# EAGLE design squid version 14 (EAGLE 6.4)
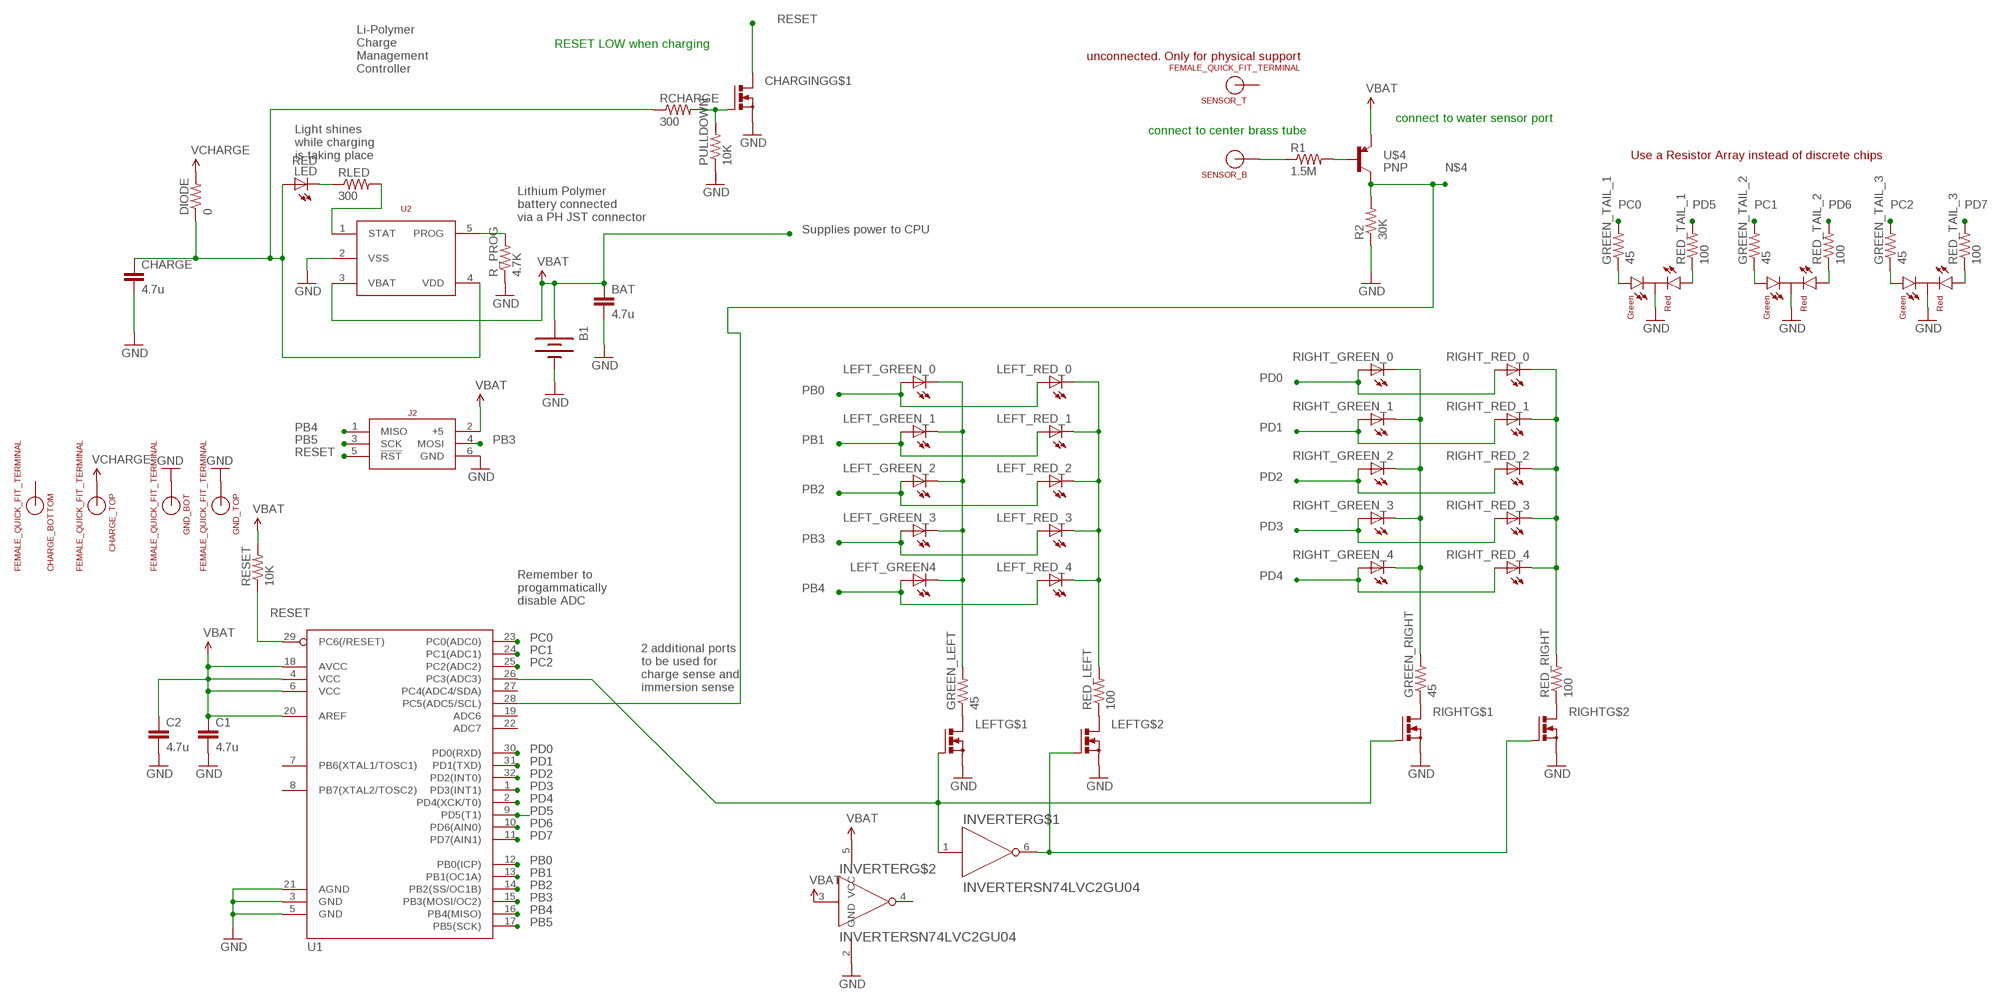
[diagram p0: schematic, sheet 1]

## Parts
B1  COIN_CELL_BATTERYJST  [JST_SM]
BAT  4.7u  CAP1206  [1206]
C1  4.7u  CAP1206  [1206]
C2  4.7u  CAP1206  [1206]
CENTER  LED_RED_GREEN_CC  [LED_KINGBRIGHT_BICOLOR_INDICATOR_LAMP]
CHARGE  4.7u  CAP1206  [1206]
CHARGE_BOTTOM  FEMALE_QUICK_FIT_TERMINAL  [HORIZONTAL_QUICK_CONNECT_3547]
CHARGE_TOP  FEMALE_QUICK_FIT_TERMINAL  [HORIZONTAL_QUICK_CONNECT_3547]
CHARGING  MOSFET_N_DUAL  [SOT-23-6]
DIODE  0  RESISTOR0805-RES  [0805]
GND_BOT  FEMALE_QUICK_FIT_TERMINAL  [HORIZONTAL_QUICK_CONNECT_3547]
GND_TOP  FEMALE_QUICK_FIT_TERMINAL  [HORIZONTAL_QUICK_CONNECT_3547]
GREEN_LEFT  45  RESISTOR0805-RES  [0805]
GREEN_RIGHT  45  RESISTOR0805-RES  [0805]
GREEN_TAIL_1  45  RESISTOR0805-RES  [0805]
GREEN_TAIL_2  45  RESISTOR0805-RES  [0805]
GREEN_TAIL_3  45  RESISTOR0805-RES  [0805]
INVERTER  INVERTERSN74LVC2GU04  [SOT-23-6]
J2  ATMEL_PROGRAMMER_HEADERNL  [TC2030-INC-NL]
LED  RED  LEDCHIP-LED0805  [CHIP-LED0805]
LEFT  MOSFET_N_DUAL  [SOT-23-6]
LEFT_GREEN4  LEDPLCC2  [BIVAR_2-PLCC]
LEFT_GREEN_0  LEDPLCC2  [BIVAR_2-PLCC]
LEFT_GREEN_1  LEDPLCC2  [BIVAR_2-PLCC]
LEFT_GREEN_2  LEDPLCC2  [BIVAR_2-PLCC]
LEFT_GREEN_3  LEDPLCC2  [BIVAR_2-PLCC]
LEFT_RED_0  LEDPLCC2  [BIVAR_2-PLCC]
LEFT_RED_1  LEDPLCC2  [BIVAR_2-PLCC]
LEFT_RED_2  LEDPLCC2  [BIVAR_2-PLCC]
LEFT_RED_3  LEDPLCC2  [BIVAR_2-PLCC]
LEFT_RED_4  LEDPLCC2  [BIVAR_2-PLCC]
PULLDOWN  10K  RESISTOR0805-RES  [0805]
R1  1.5M  RESISTOR0805-RES  [0805]
R2  30K  RESISTOR0805-RES  [0805]
R_PROG  4.7K  RESISTOR0805-RES  [0805]
RCHARGE  300  RESISTOR0805-RES  [0805]
RED_LEFT  100  RESISTOR0805-RES  [0805]
RED_RIGHT  100  RESISTOR0805-RES  [0805]
RED_TAIL_1  100  RESISTOR0805-RES  [0805]
RED_TAIL_2  100  RESISTOR0805-RES  [0805]
RED_TAIL_3  100  RESISTOR0805-RES  [0805]
RESET  10K  RESISTOR0805-RES  [0805]
RIGHT  MOSFET_N_DUAL  [SOT-23-6]
RIGHT_GREEN_0  LEDPLCC2  [BIVAR_2-PLCC]
RIGHT_GREEN_1  LEDPLCC2  [BIVAR_2-PLCC]
RIGHT_GREEN_2  LEDPLCC2  [BIVAR_2-PLCC]
RIGHT_GREEN_3  LEDPLCC2  [BIVAR_2-PLCC]
RIGHT_GREEN_4  LEDPLCC2  [BIVAR_2-PLCC]
RIGHT_RED_0  LEDPLCC2  [BIVAR_2-PLCC]
RIGHT_RED_1  LEDPLCC2  [BIVAR_2-PLCC]
RIGHT_RED_2  LEDPLCC2  [BIVAR_2-PLCC]
RIGHT_RED_3  LEDPLCC2  [BIVAR_2-PLCC]
RIGHT_RED_4  LEDPLCC2  [BIVAR_2-PLCC]
RLED  300  RESISTOR0805-RES  [0805]
SENSOR_B  FEMALE_QUICK_FIT_TERMINAL  [HORIZONTAL_QUICK_CONNECT_3547]
SENSOR_T  FEMALE_QUICK_FIT_TERMINAL  [HORIZONTAL_QUICK_CONNECT_3547]
U1  ATMEGA328_SMT  [TQFP32-08]
U2  MCP73832  [SOT-23(OT)5_LEAD]
U$4  PNP  [SOT-23]
U$7  LED_RED_GREEN_CC  [LED_KINGBRIGHT_BICOLOR_INDICATOR_LAMP]
U$13  LED_RED_GREEN_CC  [LED_KINGBRIGHT_BICOLOR_INDICATOR_LAMP]

## Nets
GND: B1.GND(-) BAT.2 C1.2 C2.2 CENTER.2(C) CHARGE.2 CHARGING.4(S) GND_BOT.1 GND_TOP.1 INVERTER.2(GND) J2.6(GND) LEFT.1(S) LEFT.4(S) PULLDOWN.1 R2.1 R_PROG.1 RIGHT.1(S) RIGHT.4(S) U1.3(GND) U1.5(GND) U1.21(AGND) U2.2(VSS) U$7.2(C) U$13.2(C)
GREEN_LEFT_CATHODE: GREEN_LEFT.2 LEFT_GREEN4.C LEFT_GREEN_0.C LEFT_GREEN_1.C LEFT_GREEN_2.C LEFT_GREEN_3.C
N$1: R1.2 U$4.1(B)
N$2: INVERTER.6(Y) LEFT.2(G) RIGHT.2(G)
N$3: CHARGING.5(G) PULLDOWN.2 RCHARGE.2
N$4: R2.2 U1.28(PC5(ADC5/SCL)) U$4.3(C)
N$5: GREEN_LEFT.1 LEFT.3(D)
N$6: LEFT.6(D) RED_LEFT.1
N$7: INVERTER.1(A) LEFT.5(G) RIGHT.5(G) U1.26(PC3(ADC3))
N$8: GREEN_RIGHT.1 RIGHT.3(D)
N$9: R1.1 SENSOR_B.1
N$10: RED_RIGHT.1 RIGHT.6(D)
N$11: GREEN_RIGHT.2 RIGHT_GREEN_0.C RIGHT_GREEN_1.C RIGHT_GREEN_2.C RIGHT_GREEN_3.C RIGHT_GREEN_4.C
N$12: RED_RIGHT.2 RIGHT_RED_0.C RIGHT_RED_1.C RIGHT_RED_2.C RIGHT_RED_3.C RIGHT_RED_4.C
N$14: LED.C RLED.1
N$15: R_PROG.2 U2.5(PROG)
N$17: GREEN_TAIL_1.1 U$7.3(GREEN)
N$20: CENTER.3(GREEN) GREEN_TAIL_2.1
N$21: CHARGE.1 DIODE.1 LED.A RCHARGE.1 U2.4(VDD)
N$22: GREEN_TAIL_3.1 U$13.3(GREEN)
N$23: RED_TAIL_1.1 U$7.1(RED)
N$24: CENTER.1(RED) RED_TAIL_2.1
N$25: RED_TAIL_3.1 U$13.1(RED)
PB0: LEFT_GREEN_0.A LEFT_RED_0.A U1.12(PB0(ICP))
PB1: LEFT_GREEN_1.A LEFT_RED_1.A U1.13(PB1(OC1A))
PB2: LEFT_GREEN_2.A LEFT_RED_2.A U1.14(PB2(SS/OC1B))
PB3: J2.4(MOSI) LEFT_GREEN_3.A LEFT_RED_3.A U1.15(PB3(MOSI/OC2))
PB4: J2.1(MISO) LEFT_GREEN4.A LEFT_RED_4.A U1.16(PB4(MISO))
PB5: J2.3(SCK) U1.17(PB5(SCK))
PC0: GREEN_TAIL_1.2 U1.23(PC0(ADC0))
PC1: GREEN_TAIL_2.2 U1.24(PC1(ADC1))
PC2: GREEN_TAIL_3.2 U1.25(PC2(ADC2))
PD0: RIGHT_GREEN_0.A RIGHT_RED_0.A U1.30(PD0(RXD))
PD1: RIGHT_GREEN_1.A RIGHT_RED_1.A U1.31(PD1(TXD))
PD2: RIGHT_GREEN_2.A RIGHT_RED_2.A U1.32(PD2(INT0))
PD3: RIGHT_GREEN_3.A RIGHT_RED_3.A U1.1(PD3(INT1))
PD4: RIGHT_GREEN_4.A RIGHT_RED_4.A U1.2(PD4(XCK/T0))
PD5: RED_TAIL_1.2 U1.9(PD5(T1))
PD6: RED_TAIL_2.2 U1.10(PD6(AIN0))
PD7: RED_TAIL_3.2 U1.11(PD7(AIN1))
RED_LEFT_CATHODE: LEFT_RED_0.C LEFT_RED_1.C LEFT_RED_2.C LEFT_RED_3.C LEFT_RED_4.C RED_LEFT.2
RESET: CHARGING.3(D) J2.5(!RST!) RESET.1 U1.29(PC6(/RESET))
STAT: RLED.2 U2.1(STAT)
VBAT: B1.VCC(+) BAT.1 C1.1 C2.1 INVERTER.3(A) INVERTER.5(VCC) J2.2(+5) RESET.2 U1.4(VCC) U1.6(VCC) U1.18(AVCC) U1.20(AREF) U2.3(VBAT) U$4.2(E)
VCHARGE: CHARGE_TOP.1 DIODE.2
Unconnected: CHARGE_BOTTOM.1 CHARGING.1(S) CHARGING.2(G) CHARGING.6(D) INVERTER.4(Y) SENSOR_T.1 U1.7(PB6(XTAL1/TOSC1)) U1.8(PB7(XTAL2/TOSC2)) U1.19(ADC6) U1.22(ADC7) U1.27(PC4(ADC4/SDA))

## Notes on the sheet
- RESET LOW when charging
- unconnected. Only for physical support
- Li-Polymer
  Charge
  Management
  Controller
- connect to water sensor port
- connect to center brass tube
- Light shines
  while charging
  is taking place
- Use a Resistor Array instead of discrete chips
- Lithium Polymer
  battery connected
  via a PH JST connector
- Supplies power to CPU
- Remember to
  progammatically
  disable ADC
- 2 additional ports
  to be used for
  charge sense and
  immersion sense

## Library data of the parts
B1 = Keystone:COIN_CELL_BATTERY
BAT C1 C2 CHARGE = SparkFun:CAP: Capacitor Standard 0603 ceramic capacitor, and 0.1" leaded capacitor.
CENTER U$7 U$13 = ERIC:LED_RED_GREEN_CC
CHARGE_BOTTOM CHARGE_TOP GND_BOT GND_TOP SENSOR_B SENSOR_T = Keystone:FEMALE_QUICK_FIT_TERMINAL
CHARGING LEFT RIGHT = ERIC:MOSFET_N_DUAL
DIODE PULLDOWN R1 R2 R_PROG RCHARGE RESET RLED = SparkFun:RESISTOR: Resistor Basic schematic elements and footprints for 0603, 1206, and PTH resistors.
GREEN_LEFT GREEN_RIGHT GREEN_TAIL_1-GREEN_TAIL_3 RED_LEFT RED_RIGHT RED_TAIL_1-RED_TAIL_3 = SparkFun-Passives:RESISTOR: Resistor Basic schematic elements and footprints for 0603, 1206, and PTH resistors.
INVERTER = ERIC:INVERTER: Dual NOT gate
J2 = ERIC:ATMEL_PROGRAMMER_HEADER: Board connector for Atmel MkII ISP programmer
LED = led:LED: LED OSRAM: - CHIPLED LG R971, LG N971, LY N971, LG Q971, LY Q971, LO R971, LY R971 LH N974, LH R974 LS Q976, LO Q976, LY Q976 LO Q996 - Hyper CHIPLED LW Q18S LB Q993, LB Q99A, LB R99A - SideLED LS A670, LO A670, LY A670, LG A670, LP A670 LB A673, LV A673, LT A673, LW A673 LH A674 LY A675 LS A676, LA A676, LO A676, LY A676, LW A676 LS A679, LY A679, LG A679 - Hyper Micro SIDELED® LS Y876, LA Y876, LO Y876, LY Y876 LT Y87S - SmartLED LW L88C, LW L88S LB L89C, LB L89S, LG L890 LS L89K, LO L89K, LY L89K LS L896, LA L896, LO L896, LY L896 - TOPLED LS T670, LO T670, LY T670, LG T670, LP T670 LSG T670, LSP T670, LSY T670, LOP T670, LYG T670 LG T671, LOG T671, LSG T671 LB T673, LV T673, LT T673, LW T673 LH T674 LS T676, LA T676, LO T676, LY T676, LB T676, LH T676, LSB T676, LW T676 LB T67C, LV T67C, LT T67C, LS T67K, LO T67K, LY T67K, LW E67C LS E67B, LA E67B, LO E67B, LY E67B, LB E67C, LV E67C, LT E67C LW T67C LS T679, LY T679, LG T679 LS T770, LO T770, LY T770, LG T770, LP T770 LB T773, LV T773, LT T773, LW T773 LH T774 LS E675, LA E675, LY E675, LS T675 LS T776, LA T776, LO T776, LY T776, LB T776 LHGB T686 LT T68C, LB T68C - Hyper Mini TOPLED® LB M676 - Mini TOPLED Santana® LG M470 LS M47K, LO M47K, LY M47K Source: http://www.osram.convergy.de LUXEON: - LUMILED® LXK2-PW12-R00, LXK2-PW12-S00, LXK2-PW14-U00, LXK2-PW14-V00 LXK2-PM12-R00, LXK2-PM12-S00, LXK2-PM14-U00 LXK2-PE12-Q00, LXK2-PE12-R00, LXK2-PE12-S00, LXK2-PE14-T00, LXK2-PE14-U00 LXK2-PB12-K00, LXK2-PB12-L00, LXK2-PB12-M00, LXK2-PB14-N00, LXK2-PB14-P00, LXK2-PB14-Q00 LXK2-PR12-L00, LXK2-PR12-M00, LXK2-PR14-Q00, LXK2-PR14-R00 LXK2-PD12-Q00, LXK2-PD12-R00, LXK2-PD12-S00 LXK2-PH12-R00, LXK2-PH12-S00 LXK2-PL12-P00, LXK2-PL12-Q00, LXK2-PL12-R00 Source: www.luxeon.com KINGBRIGHT: KA-3528ASYC Source: www.kingbright.com
LEFT_GREEN4 LEFT_GREEN_0 LEFT_GREEN_1-LEFT_GREEN_3 LEFT_RED_0 LEFT_RED_1-LEFT_RED_4 RIGHT_GREEN_0 RIGHT_GREEN_1-RIGHT_GREEN_4 RIGHT_RED_0 RIGHT_RED_1-RIGHT_RED_4 = ERIC:LED: LED OSRAM: - CHIPLED LG R971, LG N971, LY N971, LG Q971, LY Q971, LO R971, LY R971 LH N974, LH R974 LS Q976, LO Q976, LY Q976 LO Q996 - Hyper CHIPLED LW Q18S LB Q993, LB Q99A, LB R99A - SideLED LS A670, LO A670, LY A670, LG A670, LP A670 LB A673, LV A673, LT A673, LW A673 LH A674 LY A675 LS A676, LA A676, LO A676, LY A676, LW A676 LS A679, LY A679, LG A679 - Hyper Micro SIDELED® LS Y876, LA Y876, LO Y876, LY Y876 LT Y87S - SmartLED LW L88C, LW L88S LB L89C, LB L89S, LG L890 LS L89K, LO L89K, LY L89K LS L896, LA L896, LO L896, LY L896 - TOPLED LS T670, LO T670, LY T670, LG T670, LP T670 LSG T670, LSP T670, LSY T670, LOP T670, LYG T670 LG T671, LOG T671, LSG T671 LB T673, LV T673, LT T673, LW T673 LH T674 LS T676, LA T676, LO T676, LY T676, LB T676, LH T676, LSB T676, LW T676 LB T67C, LV T67C, LT T67C, LS T67K, LO T67K, LY T67K, LW E67C LS E67B, LA E67B, LO E67B, LY E67B, LB E67C, LV E67C, LT E67C LW T67C LS T679, LY T679, LG T679 LS T770, LO T770, LY T770, LG T770, LP T770 LB T773, LV T773, LT T773, LW T773 LH T774 LS E675, LA E675, LY E675, LS T675 LS T776, LA T776, LO T776, LY T776, LB T776 LHGB T686 LT T68C, LB T68C - Hyper Mini TOPLED® LB M676 - Mini TOPLED Santana® LG M470 LS M47K, LO M47K, LY M47K Source: http://www.osram.convergy.de LUXEON: - LUMILED® LXK2-PW12-R00, LXK2-PW12-S00, LXK2-PW14-U00, LXK2-PW14-V00 LXK2-PM12-R00, LXK2-PM12-S00, LXK2-PM14-U00 LXK2-PE12-Q00, LXK2-PE12-R00, LXK2-PE12-S00, LXK2-PE14-T00, LXK2-PE14-U00 LXK2-PB12-K00, LXK2-PB12-L00, LXK2-PB12-M00, LXK2-PB14-N00, LXK2-PB14-P00, LXK2-PB14-Q00 LXK2-PR12-L00, LXK2-PR12-M00, LXK2-PR14-Q00, LXK2-PR14-R00 LXK2-PD12-Q00, LXK2-PD12-R00, LXK2-PD12-S00 LXK2-PH12-R00, LXK2-PH12-S00 LXK2-PL12-P00, LXK2-PL12-Q00, LXK2-PL12-R00 Source: www.luxeon.com KINGBRIGHT: KA-3528ASYC Source: www.kingbright.com
U1 = SparkFun-DigitalIC:ATMEGA328_SMT: 32-Pin Atmega328 part Commonly used on Arduino compatible boards Available in QFP and QFN packages TQFP is IC-09069 QFN is non-stock; PROD_ID: IC-09069; VALUE: ATMEGA328P
U2 = ERIC:MCP73832: Lithium Ion/Lithium Polymer Charge Management Controller
U$4 = ERIC:PNP

## Net classes
0 default: width 0.3 mm

## Board
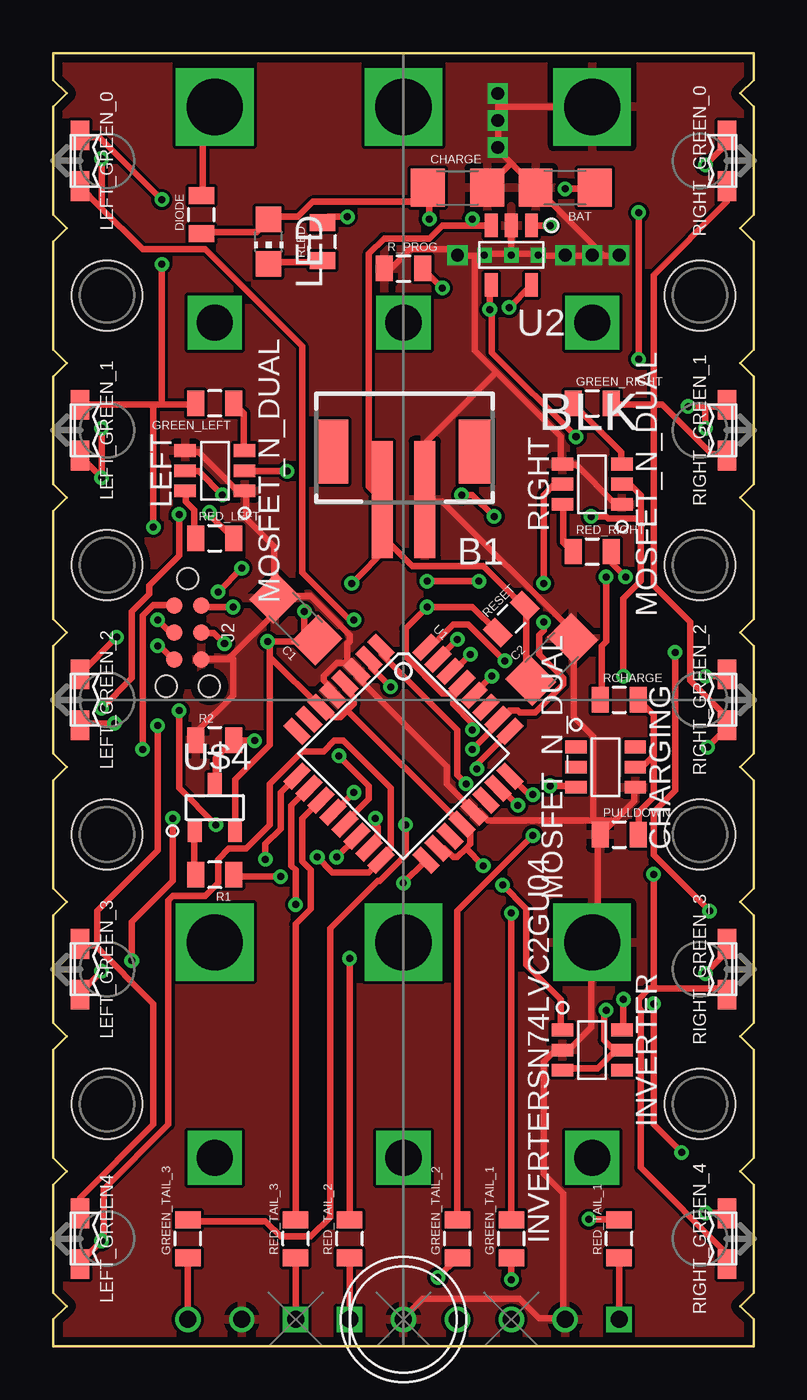
[diagram p1: board, top side]
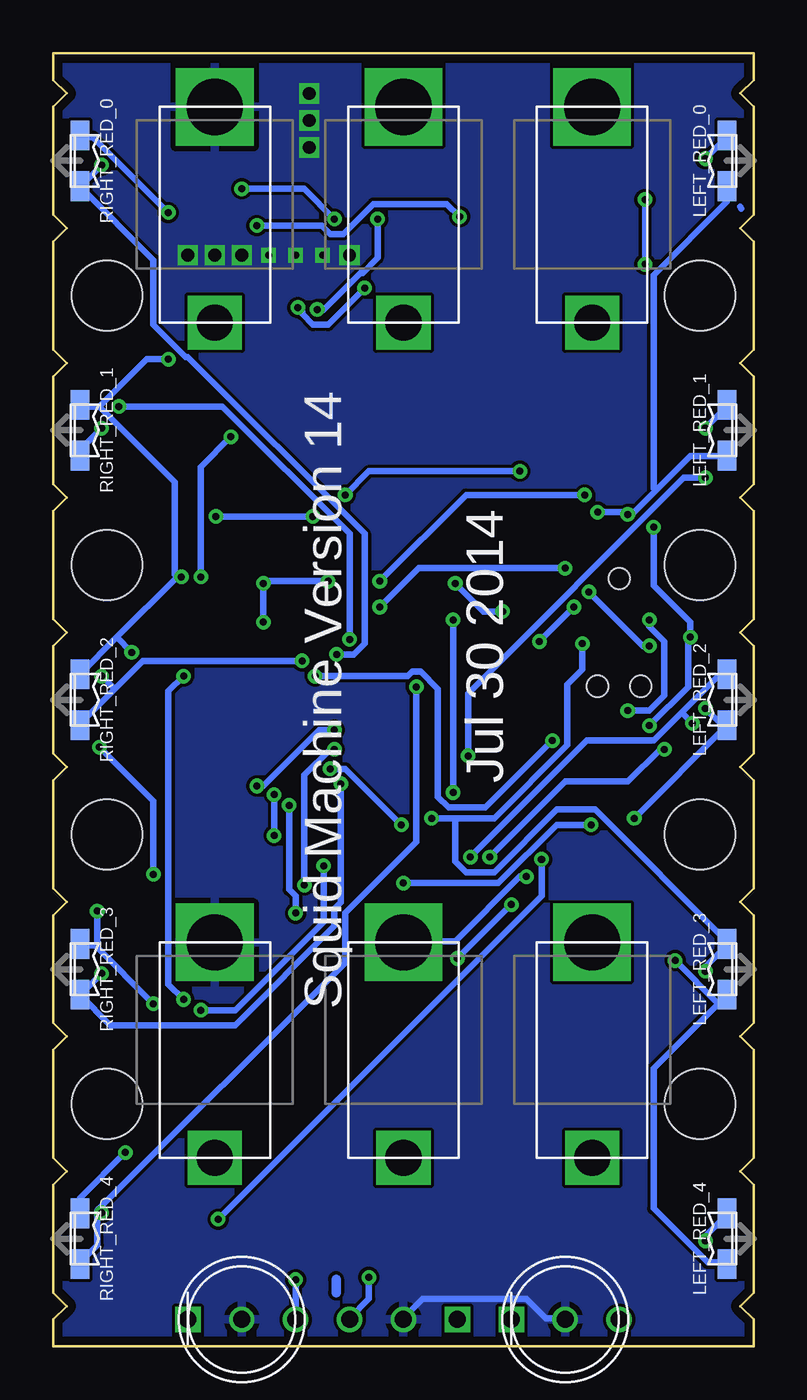
[diagram p2: board, bottom side, seen from below]

Size 33.02 x 60.96 mm. Coordinates in mm from the lower left corner, seen from the top.
Copper layers (1*16): Top 0.0356mm / dielectric 1.5011mm / Bottom 0.0356mm
Design rules "LaenPCBOrder *": minimum track width 6mil, minimum drill 13mil, track to track 6mil, track to pad 6mil, pad to pad 6mil, via to via 6mil, smd to smd 6mil, copper to edge 15mil, drill to drill 6mil, minimum pad ring 7mil, minimum via ring 7mil, stop-mask expansion 4mil, vias tented up to drill 0mil, thermal gap 10mil
Holes 3.3 mm at 2.54,11.43 30.48,11.43 2.54,49.53 30.48,49.53 2.54,36.83 2.54,24.13 30.48,24.13 30.48,36.83

### Footprints (pad centres in the part's own frame; a part is rotated, then mirrored left to right if it is on the bottom)
JST_SM = smd 1 x 5.5: GND 1,-2; VCC -1,-2 | smd 1.6 x 3: P$1 -3.4,0.27; P$2 3.4,0.27
1206 = smd 1.6 x 1.8: 1 -1.4,0; 2 1.4,0
LED_KINGBRIGHT_BICOLOR_INDICATOR_LAMP = drill 0.8 square: 1 0,2.54 | drill 0.8: 2 0,0; 3 0,-2.54
HORIZONTAL_QUICK_CONNECT_3547 = drill 2.642 square: 1 0,5.08 | drill 1.702 square: 2 0,-5.08
SOT-23-6 = smd 0.6 x 1: 1 -0.95,-1.4; 2 0,-1.4; 3 0.95,-1.4; 4 0.95,1.4; 5 0,1.4; 6 -0.95,1.4
0805 = smd 0.8 x 1.2: 1 -0.9,0; 2 0.9,0
TC2030-INC-NL = smd 0.787 x 0.787: 1 1.27,-0.635; 2 1.27,0.635; 3 2.54,-0.635; 4 2.54,0.635; 5 3.81,-0.635; 6 3.81,0.635 | hole 0.991: 0,0; 5.08,1.016; 5.08,-1.016
CHIP-LED0805 = smd 1.2 x 1.2: A 0,-1.05; C 0,1.05
BIVAR_2-PLCC = smd 1.397 x 0.889: A 1.194,0; C -1.194,0
TQFP32-08 = smd 1.27 x 0.559: 1 -4.293,2.8; 2 -4.293,2; 3 -4.293,1.2; 4 -4.293,0.4; 5 -4.293,-0.4; 6 -4.293,-1.2; 7 -4.293,-2; 8 -4.293,-2.8; 17 4.293,-2.8; 18 4.293,-2; 19 4.293,-1.2; 20 4.293,-0.4; 21 4.293,0.4; 22 4.293,1.2; 23 4.293,2; 24 4.293,2.8 | smd 0.559 x 1.27: 9 -2.8,-4.293; 10 -2,-4.293; 11 -1.2,-4.293; 12 -0.4,-4.293; 13 0.4,-4.293; 14 1.2,-4.293; 15 2,-4.293; 16 2.8,-4.293; 25 2.8,4.293; 26 2,4.293; 27 1.2,4.293; 28 0.4,4.293; 29 -0.4,4.293; 30 -1.2,4.293; 31 -2,4.293; 32 -2.8,4.293
SOT-23(OT)5_LEAD = smd 0.6 x 1.1: 1 -0.95,-1.4; 2 0,-1.4; 3 0.95,-1.4; 4 0.95,1.4; 5 -0.95,1.4
SOT-23 = smd 0.65 x 1.05: 1 -0.95,-1.1; 2 0.95,-1.1; 3 0,1.1

### Placement (x,y rotation side)
B1  16.51,41.91 0 top
BAT  24.13,54.61 180 top
C1  11.43,34.29 135 top
C2  23.5,32.38 45 top
CENTER  16.51,1.27 90 top
CHARGE  19.05,54.61 0 top
CHARGE_BOTTOM  7.62,13.97 0 bottom
CHARGE_TOP  7.62,53.34 0 bottom
CHARGING  26.04,27.3 270 top
DIODE  6.99,53.34 90 top
GND_BOT  25.4,53.34 0 bottom
GND_TOP  25.4,13.97 0 bottom
GREEN_LEFT  7.62,44.45 180 top
GREEN_RIGHT  25.4,44.45 0 top
GREEN_TAIL_1  21.59,5.08 90 top
GREEN_TAIL_2  19.05,5.08 90 top
GREEN_TAIL_3  6.35,5.08 90 top
INVERTER  25.4,13.97 270 top
J2  6.35,36.2 270 top
LED  10.16,52.07 180 top
LEFT  7.62,41.27 90 top
LEFT_GREEN4  1.27,5.08 270 top
LEFT_GREEN_0  1.27,55.88 270 top
LEFT_GREEN_1  1.27,43.18 270 top
LEFT_GREEN_2  1.27,30.48 270 top
LEFT_GREEN_3  1.27,17.78 270 top
LEFT_RED_0  1.27,55.88 90 bottom
LEFT_RED_1  1.27,43.18 90 bottom
LEFT_RED_2  1.27,30.48 90 bottom
LEFT_RED_3  1.27,17.78 90 bottom
LEFT_RED_4  1.27,5.08 90 bottom
PULLDOWN  26.67,24.13 0 top
R1  7.62,22.23 180 top
R2  7.62,28.57 0 top
R_PROG  16.51,50.8 0 top
RCHARGE  26.67,30.48 0 top
RED_LEFT  7.62,38.1 0 top
RED_RIGHT  25.4,37.47 0 top
RED_TAIL_1  26.67,5.08 90 top
RED_TAIL_2  13.97,5.08 90 top
RED_TAIL_3  11.43,5.08 90 top
RESET  21.59,34.29 45 top
RIGHT  25.4,40.64 90 top
RIGHT_GREEN_0  31.75,55.88 90 top
RIGHT_GREEN_1  31.75,43.18 90 top
RIGHT_GREEN_2  31.75,30.48 90 top
RIGHT_GREEN_3  31.75,17.78 90 top
RIGHT_GREEN_4  31.75,5.08 90 top
RIGHT_RED_0  31.75,55.88 270 bottom
RIGHT_RED_1  31.75,43.18 270 bottom
RIGHT_RED_2  31.75,30.48 270 bottom
RIGHT_RED_3  31.75,17.78 270 bottom
RIGHT_RED_4  31.75,5.08 270 bottom
RLED  12.7,52.07 90 top
SENSOR_B  16.51,13.97 0 bottom
SENSOR_T  16.51,53.34 0 bottom
U1  16.51,27.94 315 top
U2  21.59,51.44 180 top
U$4  7.62,25.4 0 top
U$7  24.13,1.27 90 bottom
U$12  [SQUID_14]  16.51,30.48 0 top
U$13  8.89,1.27 90 bottom

### Tracks (layer width: path | path; a pad name or v marks a point on that pad's centre or on a via)
GND  (via drill 0.33, 0.6)
  Top 0.3: 20.98,58.42 20.98,59.03 v20.96,59.05 | 20.98,58.42 20.98,57.91 v20.96,57.78 20.98,57.71 20.98,56.59 v20.96,56.52 20.98,56.39 21.59,55.78 | 21.59,55.78 22.71,54.66 BAT.2 22.81,54.56 25.86,51.51 v25.4,51.44 | 21.59,55.78 20.47,54.66 CHARGE.2 | GND_BOT.1 20.98,58.42 | RIGHT.1 26.77,39.73 26.47,39.73 24.64,41.55 24.03,41.55 RIGHT.4 23.93,41.66 23.93,42.88 20.88,45.92 | v21.59,51.44 21.59,51.51 20.37,51.51 v20.32,51.44 20.27,51.41 19.86,51.41 | v21.59,51.44 21.69,51.51 22.81,51.51 v22.86,51.44 22.91,51.41 24.13,51.41 v24.13,51.44 24.23,51.41 25.35,51.41 v25.4,51.44 | 19.86,51.41 19.05,51.41 v19.05,51.44 18.95,51.51 18.75,51.71 16.82,51.71 15.9,50.8 R_PROG.1 | v26.67,51.44 26.67,51.41 25.45,51.41 v25.4,51.44 | v21.59,51.44 U2.2 | 20.88,45.92 19.86,46.94 19.86,51.41 | 20.88,45.92 17.53,42.57 17.53,39.93 B1.GND 17.63,39.83 18.34,39.83 24.43,33.73 24.43,33.43 C2.2 24.54,33.33 24.54,29.67 25.45,28.75 25.45,24.79 | LEFT.4 6.25,42.16 6.86,42.16 8.69,40.34 8.99,40.34 LEFT.1 9.09,40.23 9.09,39.01 10.41,37.69 10.41,35.46 C1.2 | 13.87,32.21 13.97,32.21 14.28,31.9 U1.3 14.38,31.7 14.38,31.5 18.54,27.33 18.54,26.52 19.76,25.3 U1.21 19.86,25.09 20.17,25.09 20.47,24.79 25.45,24.79 | 13.87,32.21 13.36,32.21 12.75,31.6 12.75,31.39 13.16,30.99 13.16,30.79 U1.5 | 7.06,32.41 J2.6 7.16,32.41 8.28,32.41 8.38,32.51 | 8.38,32.51 10.41,34.54 10.41,35.26 C1.2 | R2.1 6.76,28.65 6.76,28.96 8.48,30.68 8.48,32.41 8.38,32.51 | 13.87,32.21 13.87,33.12 13.97,33.22 13.97,33.53 12.14,35.36 10.52,35.36 C1.2 | CENTER.2 16.51,1.32 17.42,2.23 22,2.23 22.91,1.32 24.13,1.32 U$7.2 24.03,1.42 24.03,7.21 23.11,8.13 23.11,13.41 23.62,13.92 23.93,13.92 INVERTER.2
  Top 0.3: 26.37,24.69 25.86,24.18 PULLDOWN.1 25.65,24.08 25.65,19.3 GND_TOP.1 25.35,19 25.35,15.04 24.43,14.12 24.13,14.12 INVERTER.2 | 26.37,24.69 27.38,25.7 27.38,26.31 CHARGING.4 | 25.45,24.79 26.26,24.79 26.37,24.69 | 24.03,14.02 INVERTER.2
  Bottom 0.3: U$13.2 8.89,1.32 9.8,1.32 10.72,2.23 15.6,2.23 16.51,1.32 CENTER.2
  pour Top: -7.62,68.58 40.64,68.58 40.64,-12.7 -7.62,-12.7
  pour Bottom: -5.08,73.66 38.1,73.66 38.1,-20.32 -5.08,-20.32
GND15
  Bottom 0.45: 19.68,3.17 19.68,2.54
GREEN_LEFT_CATHODE  (via drill 0.33)
  Top 0.3: LEFT_GREEN4.C 1.27,7.01 4.72,10.46 4.72,16.15 1.98,18.9 | 1.98,18.9 1.27,18.9 LEFT_GREEN_3.C | 4.72,44.4 1.27,44.4 LEFT_GREEN_1.C | 4.72,44.4 5.13,44.4 | 5.13,44.4 6.66,44.4 GREEN_LEFT.2 | v3,33.43 1.27,31.7 LEFT_GREEN_2.C | 4.72,44.4 v4.72,38.61 | v5.13,54.05 2.18,57 1.27,57 LEFT_GREEN_0.C | 5.13,44.4 v5.13,51 | v4.93,29.26 4.93,23.37 2.08,20.52 2.08,19 1.98,18.9
  Bottom 0.3: v4.72,38.61 4.72,35.87 3,34.14 v3,33.43 3.1,33.33 3.1,31.09 v4.93,29.26 | v5.13,51 v5.13,54.05
LEFT_RED_CATHODE
  Bottom 0.3: 0.64,53.72 0.59,53.63
N$1
  Top 0.3: U$4.1 6.66,24.28 6.66,22.25 R1.2
N$2  (via drill 0.33)
  Top 0.3: v26.87,16.36 26.87,14.94 INVERTER.6 | v26.87,31.6 26.87,35.26 27.69,36.07 27.69,39.01 | 27.69,39.01 27.69,40.13 27.18,40.64 RIGHT.2 | v11.02,41.25 9.09,41.25 LEFT.2 | v19.25,40.13 19.76,40.13 v20.78,39.12 | v25.35,39.12 26.06,39.12 26.16,39.01 27.69,39.01
  Bottom 0.3: v26.87,16.36 27.58,17.07 27.58,30.89 v26.87,31.6 | v11.02,41.25 18.14,41.25 v19.25,40.13 | v25.35,39.12 v20.78,39.12
N$3
  Top 0.3: 28.19,27.74 28.3,27.84 28.3,29.77 27.58,30.48 RCHARGE.2 | 28.19,27.74 27.79,27.33 27.48,27.33 CHARGING.5 | PULLDOWN.2 27.58,24.18 27.58,25.2 28.3,25.91 28.3,27.64 28.19,27.74
N$4  (via drill 0.33)
  Top 0.3: U$4.3 7.67,26.52 7.67,27.74 8.48,28.55 R2.2 8.59,28.55 v9.5,28.55 | v20.68,31.6 19.86,30.79 U1.28
  Bottom 0.3: v20.68,31.6 16.31,31.6 16.1,31.8 15.7,31.8 14.88,30.99 14.88,25.91 14.38,25.4 12.65,25.4 v9.5,28.55
N$5
  Top 0.3: LEFT.3 8.99,42.27 8.99,43.99 8.59,44.4 GREEN_LEFT.1
N$6
  Top 0.3: LEFT.6 6.25,40.23 6.25,39.83 6.66,39.42 6.66,38.1 RED_LEFT.1
N$7  (via drill 0.33)
  Top 0.3: v21.18,21.74 22.3,20.62 22.3,17.98 23.93,16.36 23.93,14.94 INVERTER.1 | v19.76,28.14 20.88,29.26 20.88,29.46 U1.26 21.08,29.57 21.49,29.97 21.89,29.97 22,29.87 22.71,29.87 24.03,31.19 24.03,31.5 22.91,32.61 22.91,33.53 23.11,33.73 v23.11,34.14 | RIGHT.5 23.62,40.64 23.11,40.13 v23.11,35.97 | v7.98,40.13 6.86,41.25 6.25,41.25 LEFT.5 | v20.07,36.07 v17.63,36.07
  Bottom 0.3: v21.18,21.74 21.18,26.92 19.96,28.14 v19.76,28.14 | v23.11,34.14 v23.11,35.97 23.01,36.07 v20.07,36.07 | v7.98,40.13 13.56,40.13 v17.63,36.07
N$8
  Top 0.3: RIGHT.3 26.77,41.66 26.77,42.16 24.54,44.4 GREEN_RIGHT.1
N$9  (via drill 0.33)
  Top 0.3: v10.72,22.15 8.59,22.15 R1.1
  Bottom 0.3: v10.72,22.15 11.02,22.15 14.07,19.1 16.51,19.1 SENSOR_B.1
N$10
  Top 0.3: RIGHT.6 24.03,39.62 24.03,37.9 24.43,37.49 RED_RIGHT.1
N$11  (via drill 0.33)
  Top 0.3: RIGHT_GREEN_4.C 31.75,4.37 27.69,8.43 27.69,15.85 27.58,15.95 27.58,16.36 28.09,16.87 28.3,16.87 | 28.3,16.87 31.55,16.87 31.75,16.66 RIGHT_GREEN_3.C | 28.3,44.4 28.7,44.4 31.04,42.06 31.75,42.06 RIGHT_GREEN_1.C | 28.3,44.4 26.37,44.4 GREEN_RIGHT.2 | 28.3,44.4 28.3,35.87 30.02,34.14 30.02,31.39 31.75,29.67 RIGHT_GREEN_2.C 31.75,29.16 v30.84,28.25 | RIGHT_GREEN_0.C 31.75,53.95 28.3,50.49 28.3,44.4 | v28.3,22.25 28.3,16.87
  Bottom 0.3: v28.3,22.25 28.3,25.7 v30.84,28.25
N$12  (via drill 0.33)
  Top 0.3: v29.62,9.14 28.3,10.46 v28.3,16.15 | v26.98,36.27 26.37,36.88 26.37,37.39 RED_RIGHT.2 | v27.58,46.53 v27.58,53.44 | v30.94,20.52 28.3,23.16 28.3,25.2 29.31,26.21 v29.31,32.72
  Bottom 0.3: RIGHT_RED_4.C 31.75,7.01 v29.62,9.14 | 31.04,18.9 v28.3,16.15 | 31.04,18.9 31.75,18.9 RIGHT_RED_3.C | 30.02,33.43 31.75,31.7 RIGHT_RED_2.C | 30.02,33.43 27.18,36.27 v26.98,36.27 27.28,36.37 27.28,40.74 30.84,44.3 | 30.84,44.3 31.75,44.3 RIGHT_RED_1.C | v27.58,53.44 31.14,57 31.75,57 RIGHT_RED_0.C | v27.58,46.53 28.6,46.53 30.84,44.3 | v30.94,20.52 30.94,19 31.04,18.9 | 30.02,33.43 v29.31,32.72
N$14
  Top 0.3: LED.C 10.21,51.1 12.65,51.1 RLED.1
N$15  (via drill 0.33)
  Top 0.3: v21.49,48.97 22.5,49.99 U2.5 | v18.34,49.89 17.42,50.8 R_PROG.2
  Bottom 0.3: v21.49,48.97 21.29,48.77 21.29,48.67 20.78,48.16 20.07,48.16 v18.34,49.89
N$17  (via drill 0.33)
  Top 0.3: v21.59,3.15 GREEN_TAIL_1.1
  Bottom 0.3: U$7.3 v21.59,3.15
N$20  (via drill 0.33)
  Top 0.3: v18.14,3.25 19.05,4.17 GREEN_TAIL_2.1
  Bottom 0.3: v18.14,3.25 18.14,2.23 19.05,1.32 CENTER.3
N$21  (via drill 0.33)
  Top 0.3: DIODE.1 7.06,52.53 9.6,52.53 10.11,53.03 LED.A 10.21,53.24 11.53,53.24 12.24,53.95 17.63,53.95 CHARGE.1 17.73,54.56 v17.73,53.14 | U2.4 20.57,49.99 v20.57,48.87 20.68,48.77 20.68,46.84 v24.64,42.88 | v26.06,36.27 26.06,33.22 25.86,33.02 25.86,30.48 RCHARGE.1
  Bottom 0.3: v20.57,48.87 20.27,48.87 18.54,50.6 18.44,50.6 17.73,51.31 v17.73,53.14 | v26.06,36.27 26.06,41.45 v24.64,42.88
N$22
  Top 0.3: U$13.3 GREEN_TAIL_3.1
N$23
  Top 0.3: U$7.1 RED_TAIL_1.1
N$24
  Top 0.3: CENTER.1 RED_TAIL_2.1
N$25
  Top 0.3: U$13.1 RED_TAIL_3.1
PB0  (via drill 0.33)
  Top 0.3: v14.17,26.11 13.26,25.2 U1.12 | v14.17,34.24 13.97,34.24 11.74,36.47 11.74,47.14 7.16,51.71 4.22,51.71 2.18,53.75 | 2.18,53.75 1.27,54.66 LEFT_GREEN_0.A | v2.29,55.98 2.29,53.85 2.18,53.75
  Bottom 0.3: v14.17,34.24 v14.17,26.11 | v2.29,55.98 1.27,57 LEFT_RED_0.A
PB1  (via drill 0.33)
  Top 0.3: v13.46,27.84 14.88,26.42 14.88,25.81 13.77,24.69 U1.13 | LEFT_GREEN_1.A 1.27,41.96 v2.29,40.95 v2.29,43.28
  Bottom 0.3: v13.46,27.84 13.46,30.79 3.3,40.95 v2.29,40.95 | v2.29,43.28 1.27,44.3 LEFT_RED_1.A
PB2  (via drill 0.33)
  Top 0.3: v13.36,23.06 14.28,23.98 U1.14 | v2.9,29.36 1.27,29.36 LEFT_GREEN_2.A
  Bottom 0.3: v13.36,23.06 7.87,28.55 4.72,28.55 3.4,29.87 | 3.4,29.87 1.68,31.6 1.27,31.6 LEFT_RED_2.A | 3.4,29.87 v2.9,29.36
PB3  (via drill 0.33)
  Top 0.3: v2.29,17.68 1.27,16.66 LEFT_GREEN_3.A | v8.08,33.12 7.57,33.63 7.06,33.63 J2.4 | v15.19,24.89 15.19,24.59 15.29,24.49 15.29,23.88 14.99,23.57 U1.15
  Bottom 0.3: v2.29,17.68 2.29,17.88 1.27,18.9 LEFT_RED_3.A 1.27,19.1 7.47,25.3 9.3,25.3 12.24,22.35 13.56,22.35 14.07,22.86 14.07,24.89 | v8.08,33.12 8.08,31.9 8.79,31.19 8.79,28.35 12.24,24.89 14.07,24.89 | v15.19,24.89 14.07,24.89
PB4  (via drill 0.33)
  Top 0.3: LEFT_GREEN4.A 1.27,3.96 v2.29,4.98 2.39,5.08 2.39,7.42 5.44,10.46 5.44,21.03 5.64,21.23 7.16,21.23 7.77,21.84 7.77,22.96 8.28,23.47 9.09,23.47 10.21,24.59 10.21,26.52 11.74,28.04 12.75,28.04 13.26,28.55 13.67,28.55 15.9,26.31 15.9,23.47 15.49,23.06 U1.16 15.39,22.86 14.88,22.35 13.16,22.35 v12.45,23.06 | v4.22,28.14 4.22,34.44 4.72,34.95 5.64,34.95 J2.1
  Bottom 0.3: v2.29,4.98 2.29,5.18 1.27,6.2 LEFT_RED_4.A | v4.22,28.14 4.42,28.14 5.94,26.62 8.89,26.62 v12.45,23.06
PB5  (via drill 0.33)
  Top 0.3: v4.93,34.24 5.44,33.73 5.64,33.73 J2.3 | v5.94,29.97 5.94,26.31 v7.67,24.59 | v16.51,21.84 17.53,22.86 U1.17
  Bottom 0.3: v4.93,34.24 4.93,33.93 4.22,33.22 4.22,30.68 4.93,29.97 v5.94,29.97 | v7.67,24.59 9.3,24.59 12.04,21.84 v16.51,21.84
PC0  (via drill 0.33)
  Top 0.3: v21.59,20.42 GREEN_TAIL_1.2 | v21.89,25.5 20.98,26.42 U1.23
  Bottom 0.3: v21.59,20.42 21.59,21.23 21.89,21.54 v21.89,25.5
PC1  (via drill 0.33)
  Top 0.3: GREEN_TAIL_2.2 19.05,20.52 v22.61,24.08 | v22.61,26.01 22.4,26.01 21.59,26.82 U1.24
  Bottom 0.3: v22.61,26.01 v22.61,24.08
PC2  (via drill 0.33)
  Top 0.3: v16.61,24.59 16.61,23.16 15.39,21.95 15.29,21.95 13.06,19.71 13.06,6.1 12.14,5.18 10.72,5.18 10.01,5.89 6.35,5.89 GREEN_TAIL_3.2 | v19.96,27.23 19.96,27.43 21.49,28.96 U1.25
  Bottom 0.3: v16.61,24.59 19.25,27.23 v19.96,27.23
PD0  (via drill 0.33)
  Top 0.3: v19.66,32.61 18.95,31.9 18.75,31.9 U1.30 | RIGHT_GREEN_0.A 31.75,56.69 v30.73,55.68
  Bottom 0.3: v19.66,32.61 18.85,32.61 18.34,33.12 18.34,38.3 26.67,46.63 26.77,46.63 28.3,48.16 28.3,51.21 31.75,54.66 RIGHT_RED_0.A 31.65,54.76 v30.73,55.68
PD1  (via drill 0.33)
  Top 0.3: v19.05,33.33 18.14,32.41 U1.31 | 30.73,44.3 31.75,44.3 RIGHT_GREEN_1.A | 30.73,44.3 v29.92,44.3 | 30.73,44.3 v30.73,43.28
  Bottom 0.3: v19.05,33.33 19.05,38.3 25.04,44.3 v29.92,44.3 | RIGHT_RED_1.A 31.75,42.27 v30.73,43.28
PD2  (via drill 0.33)
  Top 0.3: v21.29,32.31 19.56,34.04 18.85,34.04 17.83,33.02 17.63,33.02 U1.32 | v30.73,31.6 31.75,31.6 RIGHT_GREEN_2.A
  Bottom 0.3: v21.29,32.31 28.8,32.31 30.12,30.99 | 30.12,30.99 31.75,29.36 RIGHT_RED_2.A | 30.12,30.99 v30.73,31.6
PD3  (via drill 0.33)
  Top 0.3: v19.46,26.52 19.05,26.92 19.05,29.06 15.49,32.61 15.49,32.92 U1.1 | RIGHT_GREEN_3.A 31.75,18.59 v30.73,17.58
  Bottom 0.3: v19.46,26.52 19.46,20.93 19.76,20.62 19.76,19.81 24.43,15.14 30.33,15.14 31.75,16.56 RIGHT_RED_3.A 31.65,16.66 v30.73,17.58
PD4  (via drill 0.33)
  Top 0.3: v15.9,31.09 14.99,32 14.99,32.31 U1.2 | v30.73,6.3 31.75,6.3 RIGHT_GREEN_4.A
  Bottom 0.3: v15.9,31.09 15.9,23.77 19.25,20.42 19.25,18.09 30.84,6.5 | 30.84,6.5 30.94,6.4 30.94,4.78 31.75,3.96 RIGHT_RED_4.A | v30.73,6.3 30.73,6.4 30.84,6.5
PD5  (via drill 0.33)
  Top 0.3: v25.25,5.99 26.67,5.99 RED_TAIL_1.2 | v10.01,22.96 10.01,23.67 10.72,24.38 10.72,26.11 11.43,26.82 U1.9
  Bottom 0.3: v25.25,5.99 10.01,21.23 v10.01,22.96
PD6  (via drill 0.33)
  Top 0.3: v13.97,18.29 RED_TAIL_2.2 | v11.43,20.83 11.43,22.45 11.23,22.66 11.23,25.5 12.04,26.31 U1.10
  Bottom 0.3: v11.43,20.83 v13.97,18.29
PD7
  Top 0.3: RED_TAIL_3.2 11.43,19.91 12.14,20.62 12.14,22.45 11.74,22.86 11.74,24.89 12.55,25.7 U1.11
RED_LEFT_CATHODE  (via drill 0.33)
  Top 0.3: v7.37,39.32 7.37,39.22 8.48,38.1 RED_LEFT.2 | v5.64,24.89 5.64,21.95 3.71,20.02 v3.71,18.19 | v5.94,39.22 5.94,37.29 4.52,35.87 4.52,35.46 3.71,34.65 3.71,31.5 v2.29,30.07
  Bottom 0.3: 5.94,39.32 5.64,39.32 4.62,40.34 | 5.94,39.32 v7.37,39.32 | 4.62,40.34 3,41.96 1.27,41.96 LEFT_RED_1.C | LEFT_RED_0.C 1.27,53.95 4.72,50.49 4.72,40.44 4.62,40.34 | 1.68,16.15 1.27,16.56 LEFT_RED_3.C | 1.68,16.15 4.72,13.11 4.72,6.5 2.18,3.96 1.27,3.96 LEFT_RED_4.C | v5.64,24.89 1.27,29.26 LEFT_RED_2.C 1.47,29.26 v2.29,30.07 | 1.68,16.15 v3.71,18.19 | v5.94,39.22 5.94,39.32
RESET  (via drill 0.33)
  Top 0.3: v23.42,26.42 24.54,26.42 CHARGING.3 | v19.76,29.06 19.76,29.36 18.85,30.28 18.85,30.79 | 18.85,30.79 19.25,31.19 U1.29 | v4.93,33.02 5.03,33.02 5.64,32.41 J2.5 | v8.89,36.68 v7.77,35.56 | RESET.1 20.88,33.73 19.76,34.85 v17.63,34.85 16.61,33.83 16.61,32.51 18.34,30.79 18.85,30.79
  Bottom 0.3: v23.42,26.42 23.11,26.42 20.47,29.06 v19.76,29.06 | v4.93,33.02 5.23,33.02 v7.77,35.56 | v8.89,36.68 15.8,36.68 v17.63,34.85
STAT  (via drill 0.33)
  Top 0.3: v23.42,52.83 22.61,52.83 U2.1 | v13.87,53.24 12.95,53.24 12.75,53.03 RLED.2
  Bottom 0.3: v23.42,52.83 20.37,52.83 19.96,52.43 19.36,52.43 17.93,53.85 14.48,53.85 v13.87,53.24
VBAT  (via drill 0.33)
  Top 0.3: C2.1 22.5,31.5 22.3,31.7 22.3,34.85 RESET.2 22.1,34.95 20.27,36.78 16.92,36.78 15.6,38.1 15.6,39.83 B1.VCC | 19.76,52.83 18.34,52.83 17.73,52.22 15.6,52.22 14.88,51.51 14.88,40.54 15.49,39.93 B1.VCC | 19.76,52.83 20.57,52.83 U2.3 | v24.13,54.56 25.45,54.56 BAT.1 | 19.76,52.83 v19.76,53.14 | INVERTER.3 24.03,13.11 25.65,13.11 26.47,13.92 26.77,13.92 INVERTER.5 26.37,14.02 25.96,14.43 25.96,15.75 v26.06,15.85 | 19.46,23.47 19.66,23.67 19.66,24.28 19.36,24.59 U1.20 19.15,24.69 13.87,29.97 | 19.46,23.47 19.05,23.06 18.85,23.06 18.44,23.47 18.14,23.47 U1.18 | v8.48,34.85 7.06,34.85 J2.2 | 10.21,32.41 10.21,33.12 v10.11,33.22 12.34,33.22 C1.1 11.84,33.33 v11.84,34.65 | 10.21,32.41 10.21,28.35 8.59,26.72 8.59,24.38 U$4.2 | 10.21,32.41 10.31,32.41 12.55,30.18 U1.6 12.75,30.07 13.16,29.67 13.56,29.67 13.87,29.97 | 13.87,29.97 14.17,30.28 14.17,30.58 13.77,30.99 13.77,31.19 U1.4 | 19.46,23.47 v20.27,22.66 | v14.07,35.97 15.8,37.69 B1.VCC
  Bottom 0.3: v24.13,54.56 21.18,54.56 v19.76,53.14 | v10.11,33.22 v8.48,34.85 | v26.06,15.85 24.43,15.85 20.27,20.02 v20.27,22.66 | v14.07,35.97 12.75,34.65 v11.84,34.65
VCHARGE
  Top 0.3: DIODE.2 7.06,54.25 7.06,57.91 7.57,58.42 CHARGE_TOP.1

### Text on the board
tPlace: BLK
bPlace: Jul 30 2014 | Squid Machine Version 14